# Altium project IR Recieve Breakout.PrjPcb
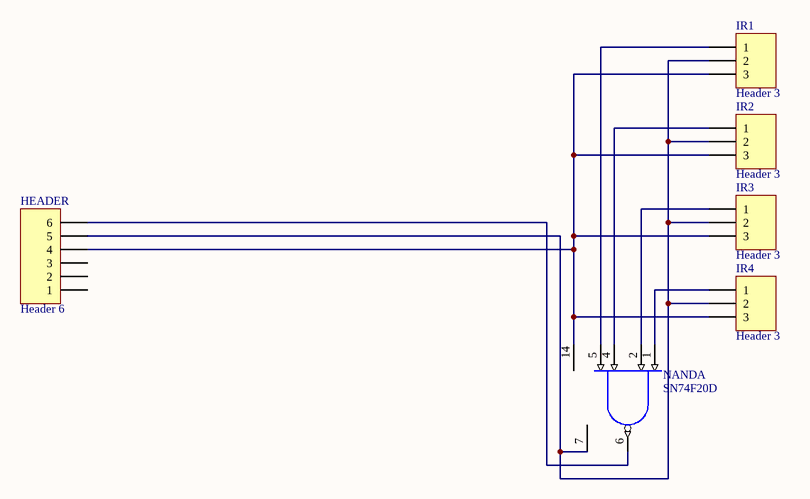
[diagram p0: Schematic.SchDoc]
1 sheet, 6 parts. Net scope: global (net labels, ports and power ports of the same name join across sheets).
Board file: PCB.PcbDoc

## Sheet Schematic.SchDoc
size A

### Parts
HEADER  Header 6  [HDR1X6]
IR1  Header 3  [HDR1X3]
IR2  Header 3  [HDR1X3]
IR3  Header 3  [HDR1X3]
IR4  Header 3  [HDR1X3]
NAND  SN74F20D  [D014_M]  (part A of 2)

### Nets
GND: HEADER.5 IR1.2 IR2.2 IR3.2 IR4.2 NAND.7(GND)
VCC: HEADER.4 IR1.3 IR2.3 IR3.3 IR4.3 NAND.14(VCC)
NetHEADER_6: HEADER.6 NAND.6(Y)
NetIR1_1: IR1.1 NAND.5(D)
NetIR2_1: IR2.1 NAND.4(C)
NetIR3_1: IR3.1 NAND.2(B)
NetIR4_1: IR4.1 NAND.1(A)

Not connected (* = marked no-connect by the designer): HEADER 1 2 3

### Library data of the parts
HEADER = Header 6: Header, 6-Pin; LatestRevisionDate: 17-Jul-2002; LatestRevisionNote: Re-released for DXP Platform.; Publisher: Altium Limited
IR1-IR4 = Header 3: Header, 3-Pin; LatestRevisionDate: 17-Jul-2002; LatestRevisionNote: Re-released for DXP Platform.; Publisher: Altium Limited
NAND = SN74F20D: Dual 4-Input Positive-NAND Gate; Note: Pins 3 and 11 are NC & not drawn.; Published: 8-Jun-2000; LatestRevisionDate: 13-Apr-2006; LatestRevisionNote: IPC-7351 Footprint Added.; DatasheetVersion: Oct-1993; PackageVersion: Jan-1998; PackageReference: D014; Publisher: Altium Limited; PackageDescription: 14-Pin Small Outline Integrated Circuit 1.27 mm Pitch; Code_IPC: SOIC127P600-14; ComponentLink1Description: Manufacturer Link; ComponentLink1URL: http://www.ti.com/; ComponentLink2Description: Datasheet; ComponentLink2URL: http://www-s.ti.com/sc/ds/SN54F20.pdf